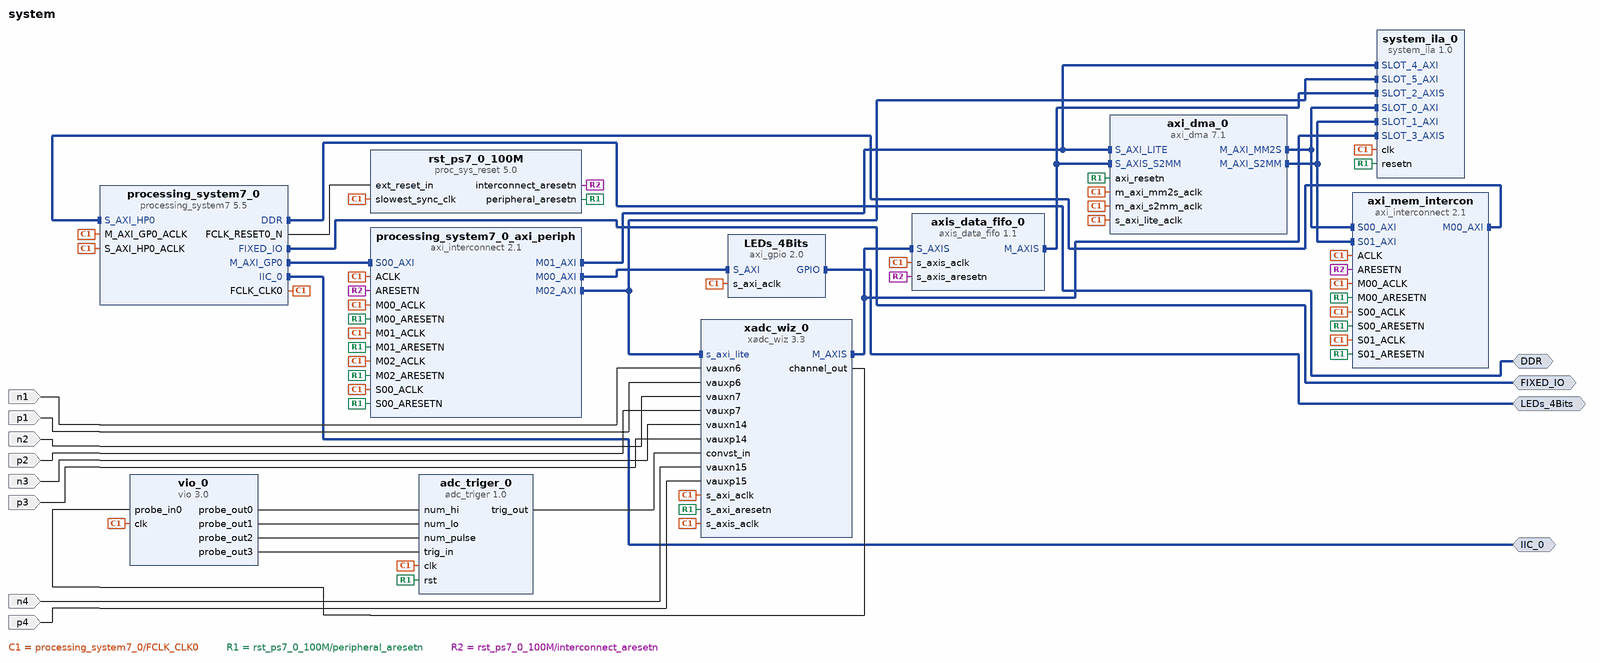
[diagram p0: block diagram of the top level]
# Vivado block design system, xc7z010clg400-1, Vivado 2017.2
create_bd_design system

create_bd_intf_port -mode Master -vlnv xilinx.com:interface:ddrx_rtl:1.0 DDR
create_bd_intf_port -mode Master -vlnv xilinx.com:display_processing_system7:fixedio_rtl:1.0 FIXED_IO
create_bd_intf_port -mode Master -vlnv xilinx.com:interface:iic_rtl:1.0 IIC_0
create_bd_intf_port -mode Master -vlnv xilinx.com:interface:gpio_rtl:1.0 LEDs_4Bits
create_bd_port -dir I n1
create_bd_port -dir I p1
create_bd_port -dir I n2
create_bd_port -dir I p2
create_bd_port -dir I n3
create_bd_port -dir I p3
create_bd_port -dir I n4
create_bd_port -dir I p4

create_bd_cell -type ip -vlnv xilinx.com:ip:axi_gpio:2.0 LEDs_4Bits
set_property -dict {CONFIG.C_GPIO_WIDTH 4 CONFIG.C_ALL_OUTPUTS 1} [get_bd_cells LEDs_4Bits]
create_bd_cell -type ip -vlnv xilinx.com:ip:axi_dma:7.1 axi_dma_0
set_property -dict {CONFIG.c_include_sg 0} [get_bd_cells axi_dma_0]
create_bd_cell -type ip -vlnv xilinx.com:ip:axi_interconnect:2.1 axi_mem_intercon
set_property -dict {CONFIG.NUM_SI 2 CONFIG.NUM_MI 1} [get_bd_cells axi_mem_intercon]
create_bd_cell -type ip -vlnv xilinx.com:ip:processing_system7:5.5 processing_system7_0
set_property -dict [list \
  CONFIG.PCW_UIPARAM_DDR_FREQ_MHZ 525.000000 \
  CONFIG.PCW_CRYSTAL_PERIPHERAL_FREQMHZ 50.000000 \
  CONFIG.PCW_APU_PERIPHERAL_FREQMHZ 650.000000 \
  CONFIG.PCW_SDIO_PERIPHERAL_FREQMHZ 50 \
  CONFIG.PCW_UART_PERIPHERAL_FREQMHZ 50 \
  CONFIG.PCW_I2C_PERIPHERAL_FREQMHZ 108.333336 \
  CONFIG.PCW_FPGA0_PERIPHERAL_FREQMHZ 100.000000 \
  CONFIG.PCW_FPGA1_PERIPHERAL_FREQMHZ 150 \
  CONFIG.PCW_FPGA2_PERIPHERAL_FREQMHZ 12.288 \
  CONFIG.PCW_FPGA3_PERIPHERAL_FREQMHZ 100.000000 \
  CONFIG.PCW_USE_S_AXI_HP0 1 \
  CONFIG.PCW_M_AXI_GP0_FREQMHZ 100 \
  CONFIG.PCW_S_AXI_HP0_FREQMHZ 100 \
  CONFIG.PCW_EN_RST1_PORT 1 \
  CONFIG.PCW_GP0_EN_MODIFIABLE_TXN 0 \
  CONFIG.PCW_GP1_EN_MODIFIABLE_TXN 0 \
  CONFIG.PCW_IMPORT_BOARD_PRESET ./lib/xml/ZYBO_zynq_def.xml \
  CONFIG.PCW_PRESET_BANK1_VOLTAGE {LVCMOS 1.8V} \
  CONFIG.PCW_UIPARAM_DDR_PARTNO {MT41K128M16 JT-125} \
  CONFIG.PCW_QSPI_PERIPHERAL_ENABLE 1 \
  CONFIG.PCW_QSPI_QSPI_IO {MIO 1 .. 6} \
  CONFIG.PCW_QSPI_GRP_SINGLE_SS_ENABLE 1 \
  CONFIG.PCW_QSPI_GRP_SINGLE_SS_IO {MIO 1 .. 6} \
  CONFIG.PCW_QSPI_GRP_FBCLK_ENABLE 1 \
  CONFIG.PCW_QSPI_GRP_FBCLK_IO {MIO 8} \
  CONFIG.PCW_ENET0_PERIPHERAL_ENABLE 1 \
  CONFIG.PCW_ENET0_ENET0_IO {MIO 16 .. 27} \
  CONFIG.PCW_ENET0_GRP_MDIO_ENABLE 1 \
  CONFIG.PCW_ENET0_GRP_MDIO_IO {MIO 52 .. 53} \
  CONFIG.PCW_SD0_PERIPHERAL_ENABLE 1 \
  CONFIG.PCW_SD0_SD0_IO {MIO 40 .. 45} \
  CONFIG.PCW_SD0_GRP_CD_ENABLE 1 \
  CONFIG.PCW_SD0_GRP_CD_IO {MIO 47} \
  CONFIG.PCW_SD0_GRP_WP_ENABLE 1 \
  CONFIG.PCW_SD0_GRP_WP_IO EMIO \
  CONFIG.PCW_UART1_PERIPHERAL_ENABLE 1 \
  CONFIG.PCW_UART1_UART1_IO {MIO 48 .. 49} \
  CONFIG.PCW_TRACE_INTERNAL_WIDTH 32 \
  CONFIG.PCW_USB0_PERIPHERAL_ENABLE 1 \
  CONFIG.PCW_USB0_USB0_IO {MIO 28 .. 39} \
  CONFIG.PCW_I2C0_PERIPHERAL_ENABLE 1 \
  CONFIG.PCW_I2C0_I2C0_IO EMIO \
  CONFIG.PCW_GPIO_PERIPHERAL_ENABLE 1 \
  CONFIG.PCW_FCLK1_PERIPHERAL_CLKSRC {DDR PLL} \
  CONFIG.PCW_FCLK2_PERIPHERAL_CLKSRC {ARM PLL} \
] [get_bd_cells processing_system7_0]
# 217 more settings of processing_system7_0 are not shown: defaults, MIO pin electricals, DDR timing, and values the tool derives
create_bd_cell -type ip -vlnv xilinx.com:ip:axi_interconnect:2.1 processing_system7_0_axi_periph
set_property -dict [list \
  CONFIG.NUM_MI 3 \
  CONFIG.STRATEGY 1 \
  CONFIG.ENABLE_ADVANCED_OPTIONS 0 \
  CONFIG.M00_HAS_REGSLICE 4 \
  CONFIG.M01_HAS_REGSLICE 4 \
  CONFIG.M02_HAS_REGSLICE 4 \
  CONFIG.M03_HAS_REGSLICE 4 \
  CONFIG.M04_HAS_REGSLICE 4 \
  CONFIG.M05_HAS_REGSLICE 4 \
  CONFIG.M06_HAS_REGSLICE 4 \
  CONFIG.M07_HAS_REGSLICE 4 \
] [get_bd_cells processing_system7_0_axi_periph]
create_bd_cell -type ip -vlnv xilinx.com:ip:system_ila:1.0 system_ila_0
set_property -dict [list \
  CONFIG.C_SLOT_0_APC_EN 0 \
  CONFIG.C_SLOT_1_APC_EN 0 \
  CONFIG.C_SLOT_2_APC_EN 0 \
  CONFIG.C_SLOT_3_APC_EN 0 \
  CONFIG.C_SLOT_4_APC_EN 0 \
  CONFIG.C_SLOT_5_APC_EN 0 \
  CONFIG.C_SLOT_0_AXI_AW_SEL_DATA 1 \
  CONFIG.C_SLOT_0_AXI_W_SEL_DATA 1 \
  CONFIG.C_SLOT_0_AXI_B_SEL_DATA 1 \
  CONFIG.C_SLOT_0_AXI_AR_SEL_DATA 1 \
  CONFIG.C_SLOT_0_AXI_R_SEL_DATA 1 \
  CONFIG.C_SLOT_1_AXI_AW_SEL_DATA 1 \
  CONFIG.C_SLOT_1_AXI_W_SEL_DATA 1 \
  CONFIG.C_SLOT_1_AXI_B_SEL_DATA 1 \
  CONFIG.C_SLOT_1_AXI_AR_SEL_DATA 1 \
  CONFIG.C_SLOT_1_AXI_R_SEL_DATA 1 \
  CONFIG.C_SLOT_4_AXI_AW_SEL_DATA 1 \
  CONFIG.C_SLOT_4_AXI_W_SEL_DATA 1 \
  CONFIG.C_SLOT_4_AXI_B_SEL_DATA 1 \
  CONFIG.C_SLOT_4_AXI_AR_SEL_DATA 1 \
  CONFIG.C_SLOT_4_AXI_R_SEL_DATA 1 \
  CONFIG.C_SLOT_5_AXI_AW_SEL_DATA 1 \
  CONFIG.C_SLOT_5_AXI_W_SEL_DATA 1 \
  CONFIG.C_SLOT_5_AXI_B_SEL_DATA 1 \
  CONFIG.C_SLOT_5_AXI_AR_SEL_DATA 1 \
  CONFIG.C_SLOT_5_AXI_R_SEL_DATA 1 \
  CONFIG.C_SLOT_0_AXI_AW_SEL_TRIG 1 \
  CONFIG.C_SLOT_0_AXI_W_SEL_TRIG 1 \
  CONFIG.C_SLOT_0_AXI_B_SEL_TRIG 1 \
  CONFIG.C_SLOT_0_AXI_AR_SEL_TRIG 1 \
  CONFIG.C_SLOT_0_AXI_R_SEL_TRIG 1 \
  CONFIG.C_SLOT_1_AXI_AW_SEL_TRIG 1 \
  CONFIG.C_SLOT_1_AXI_W_SEL_TRIG 1 \
  CONFIG.C_SLOT_1_AXI_B_SEL_TRIG 1 \
  CONFIG.C_SLOT_1_AXI_AR_SEL_TRIG 1 \
  CONFIG.C_SLOT_1_AXI_R_SEL_TRIG 1 \
  CONFIG.C_SLOT_4_AXI_AW_SEL_TRIG 1 \
  CONFIG.C_SLOT_4_AXI_W_SEL_TRIG 1 \
  CONFIG.C_SLOT_4_AXI_B_SEL_TRIG 1 \
  CONFIG.C_SLOT_4_AXI_AR_SEL_TRIG 1 \
  CONFIG.C_SLOT_4_AXI_R_SEL_TRIG 1 \
  CONFIG.C_SLOT_5_AXI_AW_SEL_TRIG 1 \
  CONFIG.C_SLOT_5_AXI_W_SEL_TRIG 1 \
  CONFIG.C_SLOT_5_AXI_B_SEL_TRIG 1 \
  CONFIG.C_SLOT_5_AXI_AR_SEL_TRIG 1 \
  CONFIG.C_SLOT_5_AXI_R_SEL_TRIG 1 \
  CONFIG.C_SLOT_2_AXI_DATA_SEL 1 \
  CONFIG.C_SLOT_3_AXI_DATA_SEL 1 \
  CONFIG.C_SLOT_2_AXI_TRIG_SEL 1 \
  CONFIG.C_SLOT_3_AXI_TRIG_SEL 1 \
  CONFIG.C_DATA_DEPTH 2048 \
  CONFIG.C_NUM_MONITOR_SLOTS 6 \
  CONFIG.C_SLOT_0_INTF_TYPE xilinx.com:interface:aximm_rtl:1.0 \
  CONFIG.C_SLOT_1_INTF_TYPE xilinx.com:interface:aximm_rtl:1.0 \
  CONFIG.C_SLOT_2_INTF_TYPE xilinx.com:interface:axis_rtl:1.0 \
  CONFIG.C_SLOT_3_INTF_TYPE xilinx.com:interface:axis_rtl:1.0 \
  CONFIG.C_SLOT_4_INTF_TYPE xilinx.com:interface:aximm_rtl:1.0 \
  CONFIG.C_SLOT_5_INTF_TYPE xilinx.com:interface:aximm_rtl:1.0 \
  CONFIG.C_MON_TYPE INTERFACE \
] [get_bd_cells system_ila_0]
create_bd_cell -type ip -vlnv xilinx.com:ip:proc_sys_reset:5.0 rst_ps7_0_100M
create_bd_cell -type ip -vlnv xilinx.com:ip:axis_data_fifo:1.1 axis_data_fifo_0
set_property -dict {CONFIG.HAS_TLAST 1} [get_bd_cells axis_data_fifo_0]
create_bd_cell -type ip -vlnv xilinx.com:ip:xadc_wiz:3.3 xadc_wiz_0
set_property -dict [list \
  CONFIG.TIMING_MODE Event \
  CONFIG.XADC_STARUP_SELECTION channel_sequencer \
  CONFIG.SEQUENCER_MODE Continuous \
  CONFIG.OT_ALARM false \
  CONFIG.USER_TEMP_ALARM false \
  CONFIG.VCCINT_ALARM false \
  CONFIG.VCCAUX_ALARM false \
  CONFIG.ENABLE_VCCPINT_ALARM false \
  CONFIG.ENABLE_VCCPAUX_ALARM false \
  CONFIG.ENABLE_VCCDDRO_ALARM false \
  CONFIG.SINGLE_CHANNEL_SELECTION TEMPERATURE \
  CONFIG.EXTERNAL_MUX_CHANNEL VP_VN \
  CONFIG.CHANNEL_ENABLE_VP_VN false \
  CONFIG.CHANNEL_ENABLE_VAUXP0_VAUXN0 false \
  CONFIG.CHANNEL_ENABLE_VAUXP1_VAUXN1 false \
  CONFIG.CHANNEL_ENABLE_VAUXP6_VAUXN6 true \
  CONFIG.CHANNEL_ENABLE_VAUXP7_VAUXN7 true \
  CONFIG.CHANNEL_ENABLE_VAUXP8_VAUXN8 false \
  CONFIG.CHANNEL_ENABLE_VAUXP9_VAUXN9 false \
  CONFIG.CHANNEL_ENABLE_VAUXP14_VAUXN14 true \
  CONFIG.CHANNEL_ENABLE_VAUXP15_VAUXN15 true \
  CONFIG.BIPOLAR_VP_VN false \
  CONFIG.BIPOLAR_VAUXP6_VAUXN6 true \
  CONFIG.BIPOLAR_VAUXP7_VAUXN7 true \
  CONFIG.BIPOLAR_VAUXP14_VAUXN14 true \
  CONFIG.BIPOLAR_VAUXP15_VAUXN15 true \
  CONFIG.ENABLE_AXI4STREAM true \
  CONFIG.FIFO_DEPTH 7 \
] [get_bd_cells xadc_wiz_0]
create_bd_cell -type ip -vlnv xilinx.com:user:adc_triger:1.0 adc_triger_0
create_bd_cell -type ip -vlnv xilinx.com:ip:vio:3.0 vio_0
set_property -dict [list \
  CONFIG.C_PROBE_OUT2_WIDTH 16 \
  CONFIG.C_PROBE_OUT1_WIDTH 8 \
  CONFIG.C_PROBE_OUT0_WIDTH 8 \
  CONFIG.C_NUM_PROBE_OUT 4 \
] [get_bd_cells vio_0]

# ---- connections ----

connect_bd_intf_net [get_bd_intf_pins LEDs_4Bits/S_AXI] [get_bd_intf_pins processing_system7_0_axi_periph/M00_AXI]
connect_bd_intf_net [get_bd_intf_pins processing_system7_0/M_AXI_GP0] [get_bd_intf_pins processing_system7_0_axi_periph/S00_AXI]
connect_bd_intf_net [get_bd_intf_pins processing_system7_0_axi_periph/M01_AXI] [get_bd_intf_pins axi_dma_0/S_AXI_LITE]
connect_bd_intf_net [get_bd_intf_pins processing_system7_0_axi_periph/M01_AXI] [get_bd_intf_pins system_ila_0/SLOT_4_AXI]
connect_bd_intf_net [get_bd_intf_pins axi_mem_intercon/M00_AXI] [get_bd_intf_pins processing_system7_0/S_AXI_HP0]
connect_bd_intf_net [get_bd_intf_pins axi_dma_0/M_AXI_MM2S] [get_bd_intf_pins axi_mem_intercon/S00_AXI]
connect_bd_intf_net [get_bd_intf_pins axi_dma_0/M_AXI_MM2S] [get_bd_intf_pins system_ila_0/SLOT_0_AXI]
connect_bd_intf_net [get_bd_intf_pins axi_dma_0/M_AXI_S2MM] [get_bd_intf_pins axi_mem_intercon/S01_AXI]
connect_bd_intf_net [get_bd_intf_pins axi_dma_0/M_AXI_S2MM] [get_bd_intf_pins system_ila_0/SLOT_1_AXI]
connect_bd_intf_net [get_bd_intf_pins axis_data_fifo_0/M_AXIS] [get_bd_intf_pins axi_dma_0/S_AXIS_S2MM]
connect_bd_intf_net [get_bd_intf_pins axis_data_fifo_0/M_AXIS] [get_bd_intf_pins system_ila_0/SLOT_2_AXIS]
connect_bd_intf_net [get_bd_intf_pins xadc_wiz_0/M_AXIS] [get_bd_intf_pins axis_data_fifo_0/S_AXIS]
connect_bd_intf_net [get_bd_intf_pins xadc_wiz_0/M_AXIS] [get_bd_intf_pins system_ila_0/SLOT_3_AXIS]
connect_bd_intf_net [get_bd_intf_pins processing_system7_0_axi_periph/M02_AXI] [get_bd_intf_pins xadc_wiz_0/s_axi_lite]
connect_bd_intf_net [get_bd_intf_pins processing_system7_0_axi_periph/M02_AXI] [get_bd_intf_pins system_ila_0/SLOT_5_AXI]
connect_bd_intf_net [get_bd_intf_ports DDR] [get_bd_intf_pins processing_system7_0/DDR]
connect_bd_intf_net [get_bd_intf_ports FIXED_IO] [get_bd_intf_pins processing_system7_0/FIXED_IO]
connect_bd_intf_net [get_bd_intf_ports IIC_0] [get_bd_intf_pins processing_system7_0/IIC_0]
connect_bd_intf_net [get_bd_intf_ports LEDs_4Bits] [get_bd_intf_pins LEDs_4Bits/GPIO]
connect_bd_net [get_bd_pins processing_system7_0/FCLK_CLK0] \
  [get_bd_pins LEDs_4Bits/s_axi_aclk] [get_bd_pins axi_dma_0/s_axi_lite_aclk] [get_bd_pins axi_dma_0/m_axi_mm2s_aclk] \
  [get_bd_pins axi_dma_0/m_axi_s2mm_aclk] [get_bd_pins processing_system7_0/M_AXI_GP0_ACLK] \
  [get_bd_pins processing_system7_0/S_AXI_HP0_ACLK] [get_bd_pins system_ila_0/clk] \
  [get_bd_pins rst_ps7_0_100M/slowest_sync_clk] [get_bd_pins axis_data_fifo_0/s_axis_aclk] \
  [get_bd_pins xadc_wiz_0/s_axi_aclk] [get_bd_pins xadc_wiz_0/s_axis_aclk] [get_bd_pins axi_mem_intercon/ACLK] \
  [get_bd_pins axi_mem_intercon/S00_ACLK] [get_bd_pins axi_mem_intercon/M00_ACLK] [get_bd_pins axi_mem_intercon/S01_ACLK] \
  [get_bd_pins processing_system7_0_axi_periph/ACLK] [get_bd_pins processing_system7_0_axi_periph/S00_ACLK] \
  [get_bd_pins processing_system7_0_axi_periph/M00_ACLK] [get_bd_pins processing_system7_0_axi_periph/M01_ACLK] \
  [get_bd_pins processing_system7_0_axi_periph/M02_ACLK] [get_bd_pins adc_triger_0/clk] [get_bd_pins vio_0/clk]
connect_bd_net [get_bd_pins processing_system7_0/FCLK_RESET0_N] [get_bd_pins rst_ps7_0_100M/ext_reset_in]
connect_bd_net [get_bd_pins rst_ps7_0_100M/peripheral_aresetn] \
  [get_bd_pins system_ila_0/resetn] [get_bd_pins xadc_wiz_0/s_axi_aresetn] [get_bd_pins axi_dma_0/axi_resetn] \
  [get_bd_pins processing_system7_0_axi_periph/S00_ARESETN] [get_bd_pins processing_system7_0_axi_periph/M00_ARESETN] \
  [get_bd_pins processing_system7_0_axi_periph/M01_ARESETN] [get_bd_pins processing_system7_0_axi_periph/M02_ARESETN] \
  [get_bd_pins axi_mem_intercon/S00_ARESETN] [get_bd_pins axi_mem_intercon/S01_ARESETN] \
  [get_bd_pins axi_mem_intercon/M00_ARESETN] [get_bd_pins adc_triger_0/rst]
connect_bd_net -net ARESETN_1 [get_bd_pins rst_ps7_0_100M/interconnect_aresetn] \
  [get_bd_pins axis_data_fifo_0/s_axis_aresetn] [get_bd_pins axi_mem_intercon/ARESETN] \
  [get_bd_pins processing_system7_0_axi_periph/ARESETN]
connect_bd_net -net vauxn6_1 [get_bd_ports n1] [get_bd_pins xadc_wiz_0/vauxn6]
connect_bd_net -net vauxp6_1 [get_bd_ports p1] [get_bd_pins xadc_wiz_0/vauxp6]
connect_bd_net -net vauxn7_1 [get_bd_ports n2] [get_bd_pins xadc_wiz_0/vauxn7]
connect_bd_net -net vauxp7_1 [get_bd_ports p2] [get_bd_pins xadc_wiz_0/vauxp7]
connect_bd_net -net vauxn14_1 [get_bd_ports n3] [get_bd_pins xadc_wiz_0/vauxn14]
connect_bd_net -net vauxp14_1 [get_bd_ports p3] [get_bd_pins xadc_wiz_0/vauxp14]
connect_bd_net -net vauxn15_1 [get_bd_ports n4] [get_bd_pins xadc_wiz_0/vauxn15]
connect_bd_net -net vauxp15_1 [get_bd_ports p4] [get_bd_pins xadc_wiz_0/vauxp15]
connect_bd_net [get_bd_pins adc_triger_0/trig_out] [get_bd_pins xadc_wiz_0/convst_in]
connect_bd_net [get_bd_pins vio_0/probe_out0] [get_bd_pins adc_triger_0/num_hi]
connect_bd_net [get_bd_pins vio_0/probe_out1] [get_bd_pins adc_triger_0/num_lo]
connect_bd_net [get_bd_pins vio_0/probe_out2] [get_bd_pins adc_triger_0/num_pulse]
connect_bd_net [get_bd_pins xadc_wiz_0/channel_out] [get_bd_pins vio_0/probe_in0]
connect_bd_net [get_bd_pins vio_0/probe_out3] [get_bd_pins adc_triger_0/trig_in]

# ---- address map ----
assign_bd_address -offset 0x00000000 -range 512M -target_address_space [get_bd_addr_spaces axi_dma_0/Data_MM2S] [get_bd_addr_segs processing_system7_0/S_AXI_HP0/HP0_DDR_LOWOCM]
assign_bd_address -offset 0x00000000 -range 512M -target_address_space [get_bd_addr_spaces axi_dma_0/Data_S2MM] [get_bd_addr_segs processing_system7_0/S_AXI_HP0/HP0_DDR_LOWOCM]
assign_bd_address -offset 0x40400000 -range 64K -target_address_space [get_bd_addr_spaces processing_system7_0/Data] [get_bd_addr_segs axi_dma_0/S_AXI_LITE/Reg]
assign_bd_address -offset 0x41200000 -range 64K -target_address_space [get_bd_addr_spaces processing_system7_0/Data] [get_bd_addr_segs LEDs_4Bits/S_AXI/Reg]
assign_bd_address -offset 0x43C00000 -range 64K -target_address_space [get_bd_addr_spaces processing_system7_0/Data] [get_bd_addr_segs xadc_wiz_0/s_axi_lite/Reg]

validate_bd_design
save_bd_design
